# EAGLE design FMBTECH (EAGLE 8.4.3)
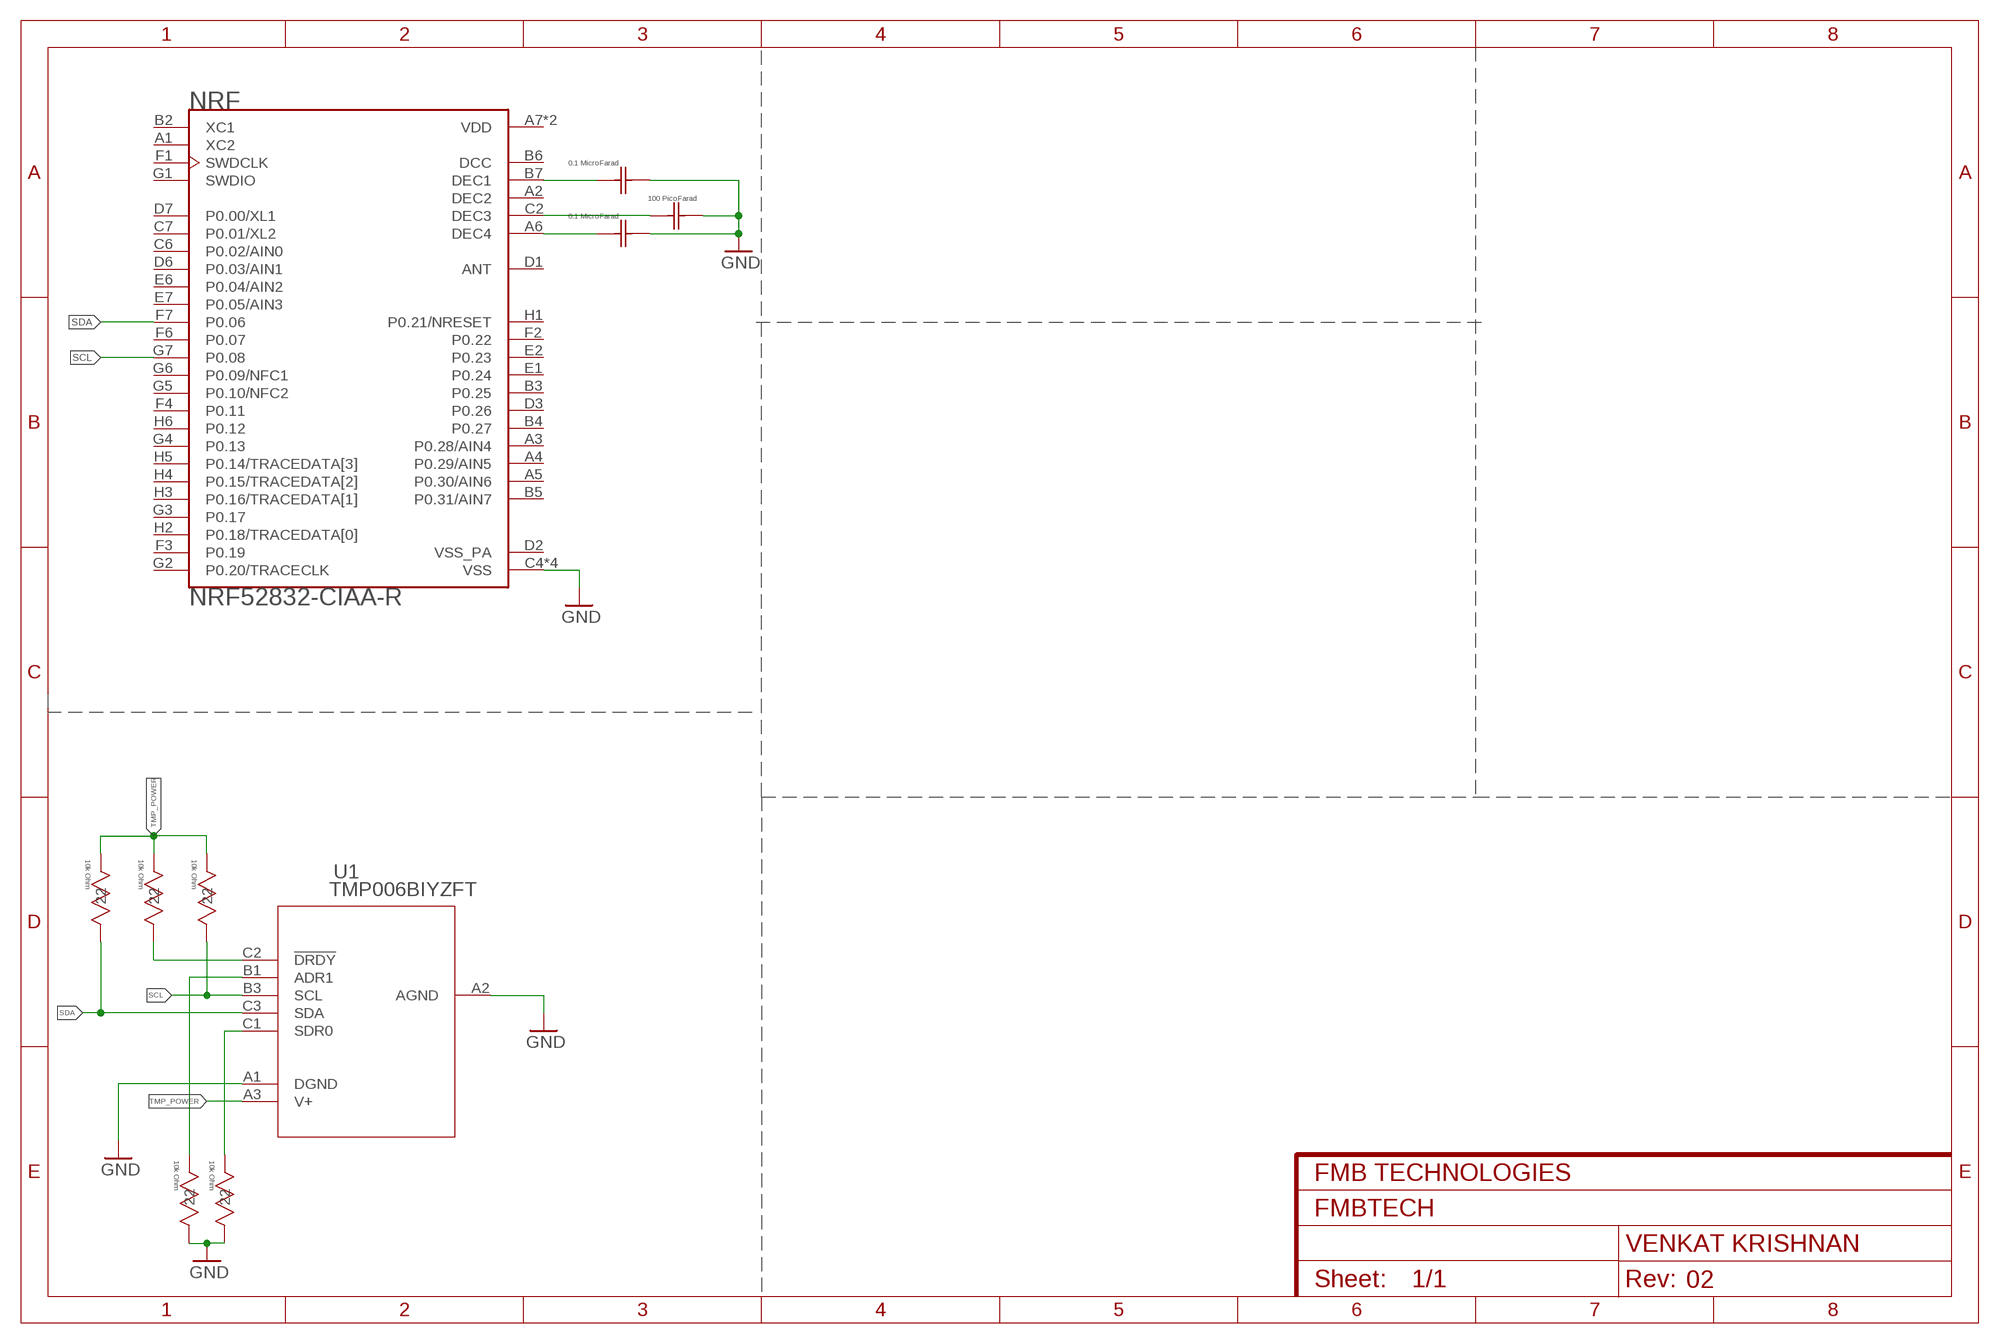
[diagram p0: schematic, sheet 1]

## Parts
C1  02016D104KAT2A  [0201]
C2  02016D104KAT2A  [0201]
C3  GRM0335C1E101JA01D  [G-033]
NRF  NRF52832-CIAA-R  [BGA50N40P7X8_300X320X40]
R1  RC0402JR-0710KL  [RC0402N]
R2  RC0402JR-0710KL  [RC0402N]
R3  RC0402JR-0710KL  [RC0402N]
R4  RC0402JR-0710KL  [RC0402N]
R5  RC0402JR-0710KL  [RC0402N]
U1  TMP006BIYZFT  [YZF8]

## Nets
GND: C1.2 C2.2 C3.2 NRF.C4(VSS) NRF.C5(VSS) NRF.E3(VSS) NRF.F5(VSS) R4.1 R5.1 U1.A1(DGND) U1.A2(AGND)
N$1: R5.2 U1.C1(SDR0)
N$3: R4.2 U1.B1(ADR1)
N$4: R3.1 U1.C2(!DRDY)
N$6: C2.1 NRF.A6(DEC4)
N$8: C1.1 NRF.B7(DEC1)
N$9: C3.1 NRF.C2(DEC3)
SCL: NRF.G7(P0.08) R2.1 U1.B3(SCL)
SDA: NRF.F7(P0.06) R1.1 U1.C3(SDA)
TMP_POWER: R1.2 R2.2 R3.2 U1.A3(V+)
Unconnected: NRF.A1(XC2) NRF.A3(P0.28/AIN4) NRF.A4(P0.29/AIN5) NRF.A5(P0.30/AIN6) NRF.B2(XC1) NRF.B3(P0.25) NRF.B4(P0.27) NRF.B5(P0.31/AIN7) NRF.C6(P0.02/AIN0) NRF.C7(P0.01/XL2) NRF.D1(ANT) NRF.D3(P0.26) NRF.D6(P0.03/AIN1) NRF.D7(P0.00/XL1) NRF.E1(P0.24) NRF.E2(P0.23) NRF.E6(P0.04/AIN2) NRF.E7(P0.05/AIN3) NRF.F1(SWDCLK) NRF.F2(P0.22) NRF.F3(P0.19) NRF.F4(P0.11) NRF.F6(P0.07) NRF.G1(SWDIO) NRF.G2(P0.20/TRACECLK) NRF.G3(P0.17) NRF.G4(P0.13) NRF.G5(P0.10/NFC2) NRF.G6(P0.09/NFC1) NRF.H1(P0.21/NRESET) NRF.H2(P0.18/TRACEDATA[0]) NRF.H3(P0.16/TRACEDATA[1]) NRF.H4(P0.15/TRACEDATA[2]) NRF.H5(P0.14/TRACEDATA[3]) NRF.H6(P0.12)

## Power pins joined to a net without a drawn wire
DCC: NRF.B6(DCC)
DEC2: NRF.A2(DEC2)
VDD: NRF.A7(VDD) NRF.H7(VDD)
VSS_PA: NRF.D2(VSS_PA)

## Library data of the parts
C1 C2 = cap_1microfarad:02016D104KAT2A; MANUFACTURER_PART_NUMBER: 02016D104KAT2A; VENDOR: AVX Corporation
C3 = cap_100picofarad:GRM0335C1E101JA01D; MANUFACTURER_PART_NUMBER: GRM0335C1E101JA01D; VENDOR: Murata
NRF = NRF52832-CIAA-R:NRF52832-CIAA-R: Multi Protocal Bluetooth Smart ANT 2.4GHz RF SoC (WL-CSP); AVAILABILITY: Good; DESCRIPTION: Multi Protocal Bluetooth Smart ANT 2.4GHz RF SoC (WL-CSP); MF: Nordic Semiconductor; MP: NRF52832-CIAA-R; PACKAGE: XFBGA-50 Nordic Semiconductor; PRICE: 3.94 USD
R1-R5 = res_10kohm:RC0402JR-0710KL; MANUFACTURER_PART_NUMBER: RC0402JR0710KL; VENDOR: Yageo
U1 = tmp006b:TMP006BIYZFT; MANUFACTURER_PART_NUMBER: TMP006BIYZFT; VENDOR: Texas Instruments

## Board
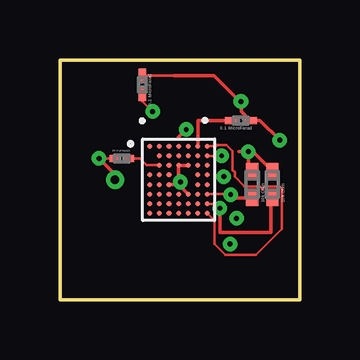
[diagram p1: board, top side]
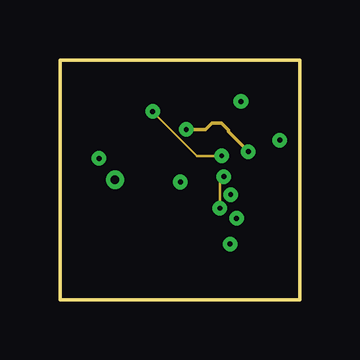
[diagram p2: board, inner layer Route4]
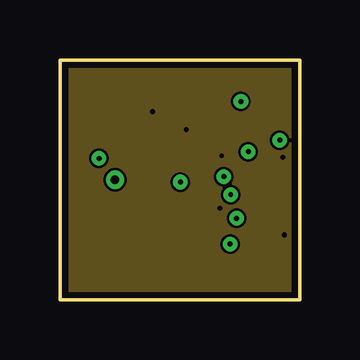
[diagram p3: board, inner layer Route8]
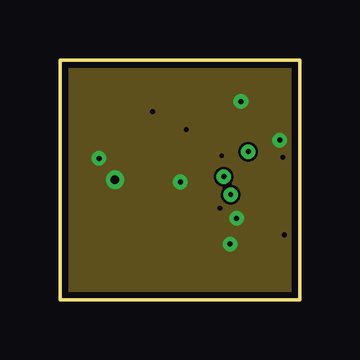
[diagram p4: board, inner layer Route10]
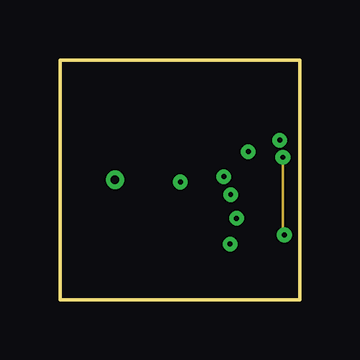
[diagram p5: board, inner layer Route12]
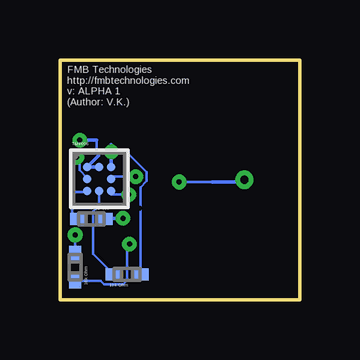
[diagram p6: board, bottom side, seen from below]

Size 10 x 10 mm. Coordinates in mm from the lower left corner, seen from the top.
Outline: 0,0 10,0 10,10 0,10 0,0
Copper layers (((1*4)*8*10)*(12*16)): Top 0.035mm / dielectric 1.5mm / Route4 0.035mm / dielectric 0.15mm / Route8 0.035mm / dielectric 0.15mm / Route10 0.035mm / dielectric 0.15mm / Route12 0.035mm / dielectric 0.15mm / Bottom 0.035mm
Design rules "default *": minimum track width 4mil, minimum drill 8mil, track to track 4mil, track to pad 4mil, pad to pad 4mil, via to via 4mil, smd to smd 2mil, copper to edge 10mil, drill to drill 10mil, minimum pad ring 10mil, minimum via ring 8mil, stop-mask expansion 4mil, vias tented up to drill 0mil, thermal gap 10mil

### Footprints (pad centres in the part's own frame; a part is rotated, then mirrored left to right if it is on the bottom)
0201 = smd 0.559 x 0.305: 1 -0.394,0; 2 0.394,0
G-033 = smd 0.406 x 0.305: 1 -0.305,0; 2 0.305,0
BGA50N40P7X8_300X320X40 = smd 0.2 x 0.2: A1 -1.2,1.4; A2 -0.8,1.4; A3 -0.4,1.4; A4 0,1.4; A5 0.4,1.4; A6 0.8,1.4; A7 1.2,1.4; B2 -0.8,1; B3 -0.4,1; B4 0,1; B5 0.4,1; B6 0.8,1; B7 1.2,1; C2 -0.8,0.6; C3 -0.4,0.6; C4 0,0.6; C5 0.4,0.6; C6 0.8,0.6; C7 1.2,0.6; D1 -1.2,0.2; D2 -0.8,0.2; D3 -0.4,0.2; D6 0.8,0.2; D7 1.2,0.2; E1 -1.2,-0.2; E2 -0.8,-0.2; E3 -0.4,-0.2; E6 0.8,-0.2; E7 1.2,-0.2; F1 -1.2,-0.6; F2 -0.8,-0.6; F3 -0.4,-0.6; F4 0,-0.6; F5 0.4,-0.6; F6 0.8,-0.6; F7 1.2,-0.6; G1 -1.2,-1; G2 -0.8,-1; G3 -0.4,-1; G4 0,-1; G5 0.4,-1; G6 0.8,-1; G7 1.2,-1; H1 -1.2,-1.4; H2 -0.8,-1.4; H3 -0.4,-1.4; H4 0,-1.4; H5 0.4,-1.4; H6 0.8,-1.4; H7 1.2,-1.4
RC0402N = smd 0.66 x 0.508: 1 -0.559,0; 2 0.559,0
YZF8 = smd 0.35 x 0.35: A1 -0.5,0.5; A2 0,0.5; A3 0.5,0.5; B1 -0.5,0; B3 0.5,0; C1 -0.5,-0.5; C2 0,-0.5; C3 0.5,-0.5

### Placement (x,y rotation side)
C1  3.43,8.96 90 top
C2  7.55,7.47 0 top
C3  2.58,5.88 180 top
NRF  4.95,5 0 top
R1  8.02,4.8 90 top
R2  8.86,4.8 90 top
R3  7.2,1.05 0 bottom
R4  9.36,1.35 90 bottom
R5  8.69,3.37 180 bottom
U1  8.36,5.04 0 bottom

### Tracks (layer width: path | path; a pad name or v marks a point on that pad's centre or on a via)
GND  (via drill 0.2, 0.2 layers 1-10, 0.35)
  Top 0.102: 4.76,9.35 4.1,9.35 4.09,9.35 C1.2 | C3.2 v1.63,5.89
  Top 0.152: NRF.F5 4.95,4.8 | 4.95,4.8 NRF.E3 | 4.95,4.8 NRF.C4 NRF.C5 | 4.95,4.8 5.03,4.88 v5.03,4.91 | v7.55,8.26 7.56,8.33 7.56,8.2 | 7.56,8.2 7.56,7.85 C2.2 8.35,7.47 v9.17,6.65 9.17,6.82 | v1.63,5.89 2.3,5.22 v2.3,5 | 4.76,9.35 6.42,9.35 7.56,8.2
  Route10 0.152: v5.03,4.91 | v5.03,4.91 | v7.55,8.26 7.55,8.32
  Bottom 0.102: R4.1 8.3,0.79 8.15,0.64 7.37,0.64 7.2,0.81 7.2,2.32 v7.1,2.32 | 3.66,4.91 v5.03,4.91 | 8.47,6.65 8.47,6.11 8.38,6.01
  Bottom 0.152: U1.A2 U1.A1 8.38,6.01 | R5.1 8.11,3.39 v7.37,3.39 | v9.17,6.65 8.47,6.65 | v2.3,5 2.4,4.91 3.66,4.91
  pour Route10 (no thermals): 0,0 10,0 10,10 0,10
N$1
  Bottom 0.102: U1.C1 8.9,4.5 9.5,4.5 9.5,3.62 R5.2
N$3  (via drill 0.2 layers 12-16)
  Route12 0.102: v9.37,2.7 9.3,2.7 v9.3,5.94
  Bottom 0.102: R4.2 v9.36,2.7 v9.37,2.7 | U1.B1 8.86,5.08 9.19,5.4 9.19,5.83 v9.3,5.94
N$4
  Bottom 0.102: U1.C2 8.36,3.94 8.61,3.68 8.61,1.9 R3.1
N$6
  Top 0.152: NRF.A6 5.75,7.47 C2.1
N$8  (via drill 0.2 layers 1-4)
  Top 0.102: C1.1 3.43,8.29 v3.87,7.85 | v6.75,6 NRF.B7
  Route4 0.102: v3.87,7.85 5.72,6 v6.75,6
N$9
  Top 0.102: C3.1 3.35,5.88 3.62,5.61 NRF.C2
SCL  (via drill 0.2, 0.2 layers 1-4)
  Top 0.102: NRF.G7 6.67,4 v6.67,3.81
  Top 0.152: R2.1 8.8,4.24 8.8,2.8 6.67,2.8 v6.67,3.81
  Route4 0.102: v6.67,3.81 6.67,5.13 v6.84,5.13
  Bottom 0.102: v6.84,5.13 7.86,5.13 U1.B3
SDA  (via drill 0.2)
  Top 0.102: NRF.F7 7.13,4.4 v7.13,4.38
  Top 0.152: R1.1 7.27,4.24 v7.13,4.38
  Bottom 0.102: v7.13,4.38 7.86,4.38 U1.C3
TMP_POWER  (via drill 0.2, 0.2 layers 1-4)
  Top 0.152: 4.95,6.78 v5.27,7.1 | R1.2 7.86,5.52 v7.86,6.17 | R2.2 8.05,6.17 v7.86,6.17 | 7.48,6.17 v7.86,6.17
  Route4 0.152: v5.27,7.1 6.08,7.1 6.34,7.36 6.74,7.36 7.02,7.08 7.02,7.01 v7.86,6.17
  Bottom 0.102: R3.2 6.64,4.68 6.38,4.94 6.38,5.32 7.23,6.17 v7.86,6.17
  Bottom 0.152: 7.86,6.48 v7.86,6.17 U1.A3
VCC
  pour Route8 (no thermals): 0,0 10,0 10,10 0,10
VDD
  Top 0.102: NRF.A7 6.5,6.4 6.56,6.46 6.94,6.46 7.21,6.19 7.21,5.41 7.3,5.32 7.3,5.13 7.7,4.72 8.34,4.72 8.44,4.62 8.54,4.72 9.18,4.72 9.27,4.63 9.27,2.94 8.18,1.86 6.91,1.86 6.44,2.33 6.44,3.31 NRF.H7

### Text on the board
bNames: FMB Technologies / http://fmbtechnologies.com / v: ALPHA 1 / (Author: V.K.)